# EAGLE design FX-Flash_PLCC_rev_C (EAGLE 9.6.2)
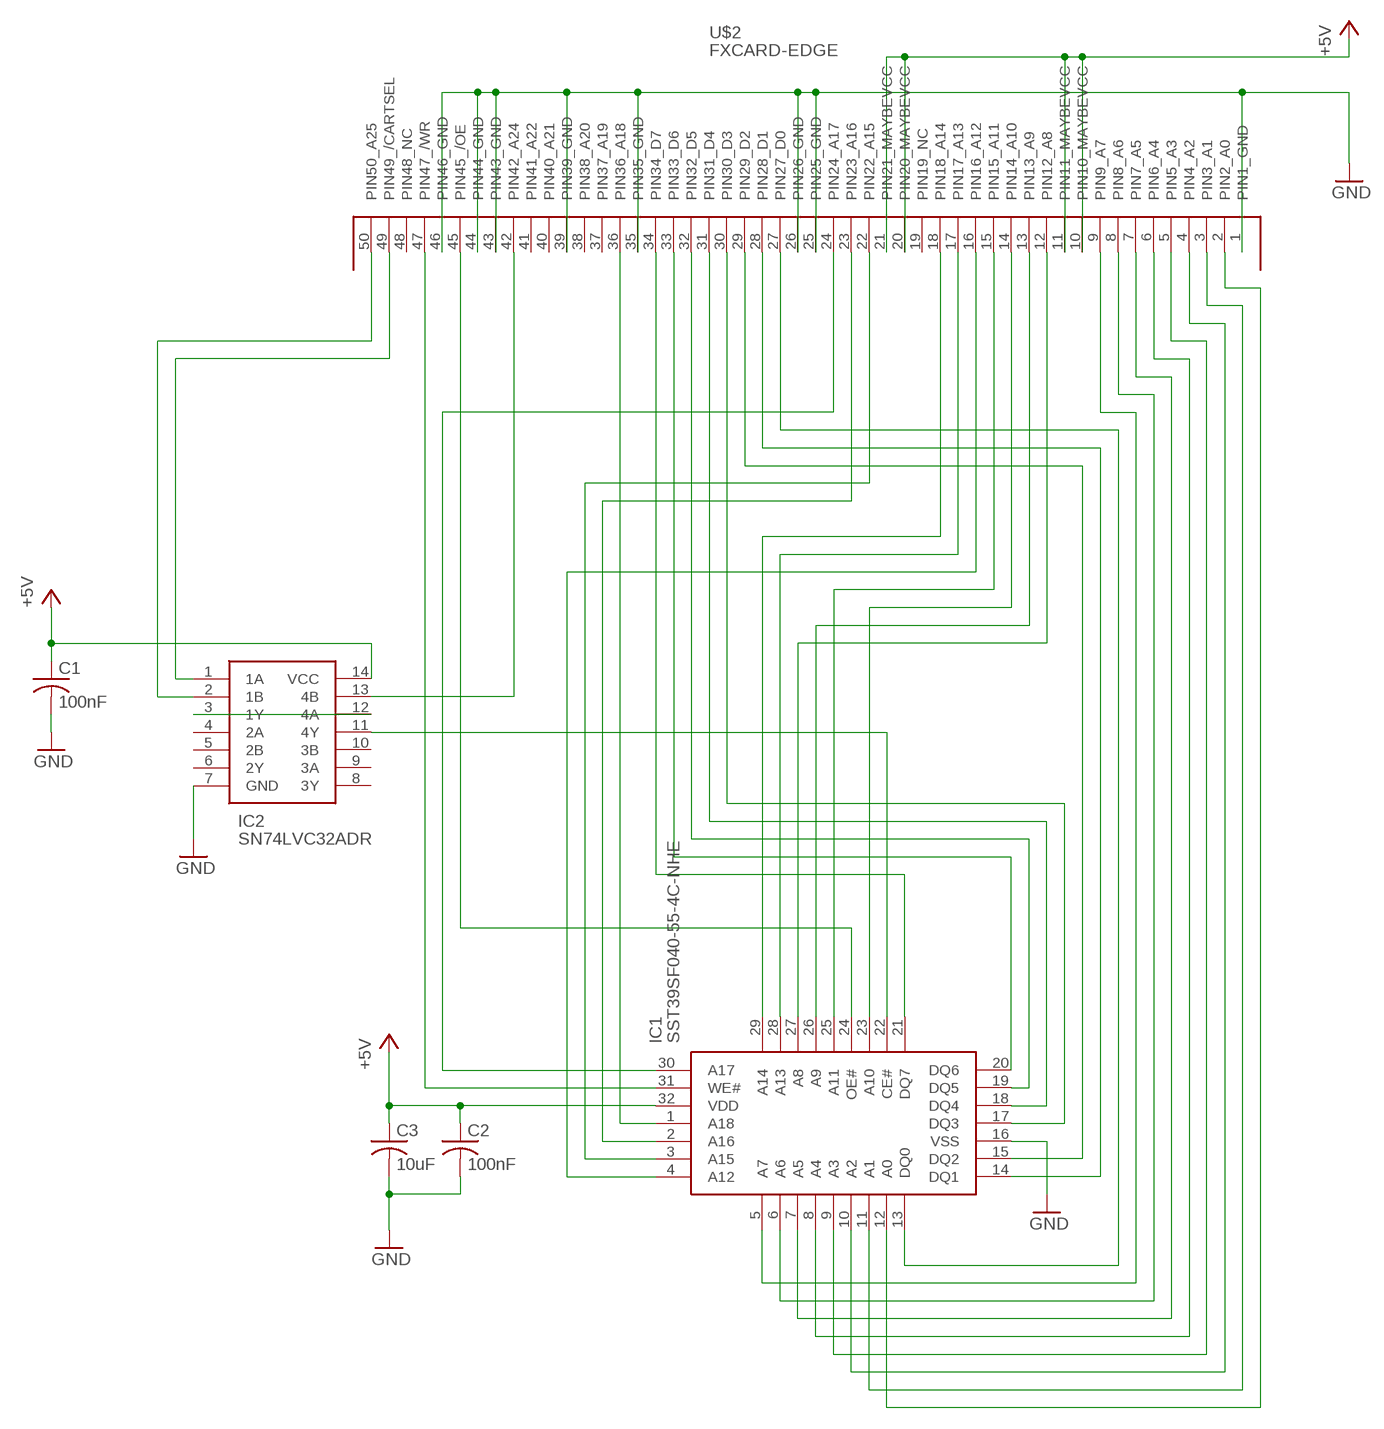
[diagram p0: schematic, sheet 1]

## Parts
C1  100nF  C-USC0805  [C0805]
C2  100nF  C-USC0805  [C0805]
C3  10uF  C-USC0805  [C0805]
IC1  SST39SF040-55-4C-NHE  [PLCC127P1245X1499X356-32N]
IC2  SN74LVC32ADR  [SOIC127P600X175-14N]
U$2  FXCARD-EDGE  [FXCARD-EDGE]

## Nets
+5V: C1.1 C2.1 C3.1 IC1.32(VDD) IC2.14(VCC) U$2.10(PIN10_MAYBEVCC) U$2.11(PIN11_MAYBEVCC) U$2.20(PIN20_MAYBEVCC) U$2.21(PIN21_MAYBEVCC)
GND: C1.2 C2.2 C3.2 IC1.16(VSS) IC2.7(GND) U$2.1(PIN1_GND) U$2.25(PIN25_GND) U$2.26(PIN26_GND) U$2.35(PIN35_GND) U$2.39(PIN39_GND) U$2.43(PIN43_GND) U$2.44(PIN44_GND) U$2.46(PIN46_GND)
N$1: IC1.18(DQ4) U$2.31(PIN31_D4)
N$2: IC1.17(DQ3) U$2.30(PIN30_D3)
N$3: IC2.13(4B) U$2.42(PIN42_A24)
N$4: IC2.3(1Y) IC2.12(4A)
N$5: IC1.22(CE#) IC2.11(4Y)
N$6: IC1.31(WE#) U$2.47(PIN47_/WR)
N$7: IC1.24(OE#) U$2.45(PIN45_/OE)
N$8: IC1.1(A18) U$2.36(PIN36_A18)
N$9: IC1.30(A17) U$2.24(PIN24_A17)
N$10: IC1.2(A16) U$2.23(PIN23_A16)
N$11: IC1.3(A15) U$2.22(PIN22_A15)
N$12: IC1.29(A14) U$2.18(PIN18_A14)
N$13: IC1.28(A13) U$2.17(PIN17_A13)
N$14: IC1.4(A12) U$2.16(PIN16_A12)
N$15: IC1.25(A11) U$2.15(PIN15_A11)
N$16: IC1.23(A10) U$2.14(PIN14_A10)
N$17: IC1.21(DQ7) U$2.34(PIN34_D7)
N$18: IC1.20(DQ6) U$2.33(PIN33_D6)
N$19: IC1.19(DQ5) U$2.32(PIN32_D5)
N$20: IC1.26(A9) U$2.13(PIN13_A9)
N$21: IC1.27(A8) U$2.12(PIN12_A8)
N$22: IC2.2(1B) U$2.50(PIN50_A25)
N$23: IC2.1(1A) U$2.49(PIN49_/CARTSEL)
N$24: IC1.15(DQ2) U$2.29(PIN29_D2)
N$25: IC1.14(DQ1) U$2.28(PIN28_D1)
N$26: IC1.13(DQ0) U$2.27(PIN27_D0)
N$27: IC1.5(A7) U$2.9(PIN9_A7)
N$28: IC1.6(A6) U$2.8(PIN8_A6)
N$29: IC1.7(A5) U$2.7(PIN7_A5)
N$30: IC1.8(A4) U$2.6(PIN6_A4)
N$31: IC1.9(A3) U$2.5(PIN5_A3)
N$32: IC1.10(A2) U$2.4(PIN4_A2)
N$33: IC1.11(A1) U$2.3(PIN3_A1)
N$34: IC1.12(A0) U$2.2(PIN2_A0)
Unconnected: IC2.4(2A) IC2.5(2B) IC2.6(2Y) IC2.8(3Y) IC2.9(3A) IC2.10(3B) U$2.19(PIN19_NC) U$2.37(PIN37_A19) U$2.38(PIN38_A20) U$2.40(PIN40_A21) U$2.41(PIN41_A22) U$2.48(PIN48_NC)

## Library data of the parts
C1-C3 = resistor:C-US: CAPACITOR, American symbol
IC1 = PC-Engine:SST39SF040-55-4C-NHE: NOR Flash 4.5 to 5.5 4Mbit Multi-Purpose Flash Source: Datasheet <http://www.microchip.com/mymicrochip/filehandler.aspx?ddocname=en551028>; ARROW_PART_NUMBER: SST39SF040-55-4C-NHE; ARROW_PRICE-STOCK: https://www.arrow.com/en/products/sst39sf040-55-4c-nhe/microchip-technology; DESCRIPTION: NOR Flash 4.5 to 5.5 4Mbit Multi-Purpose Flash; HEIGHT: 3.556mm; MANUFACTURER_NAME: Microchip; MANUFACTURER_PART_NUMBER: SST39SF040-55-4C-NHE; MOUSER_PART_NUMBER: 579-39SF0405CNHE; MOUSER_PRICE-STOCK: https://www.mouser.co.uk/ProductDetail/Microchip-Technology/SST39SF040-55-4C-NHE?qs=Ot24P6tC%2FQ41kj5UP%2FTWpA%3D%3D
IC2 = PC-Engine:SN74LVC32ADR: Texas Instruments SN74LVC32ADR, OR Quad 2 Input OR, 1.65 3.6 V, 14-Pin SOIC Source: Datasheet <http://www.ti.com/lit/gpn/sn74lvc32a>; ARROW_PART_NUMBER: SN74LVC32ADR; ARROW_PRICE-STOCK: https://www.arrow.com/en/products/sn74lvc32adr/texas-instruments; DESCRIPTION: Texas Instruments SN74LVC32ADR, OR Quad 2 Input OR, 1.65 3.6 V, 14-Pin SOIC; HEIGHT: 1.75mm; MANUFACTURER_NAME: Texas Instruments; MANUFACTURER_PART_NUMBER: SN74LVC32ADR; MOUSER_PART_NUMBER: 595-SN74LVC32ADR; MOUSER_PRICE-STOCK: https://www.mouser.co.uk/ProductDetail/Texas-Instruments/SN74LVC32ADR?qs=NLW4NjXEBS7KFLqI%2FYoHOA%3D%3D
U$2 = PC-Engine:FXCARD-EDGE

## Board
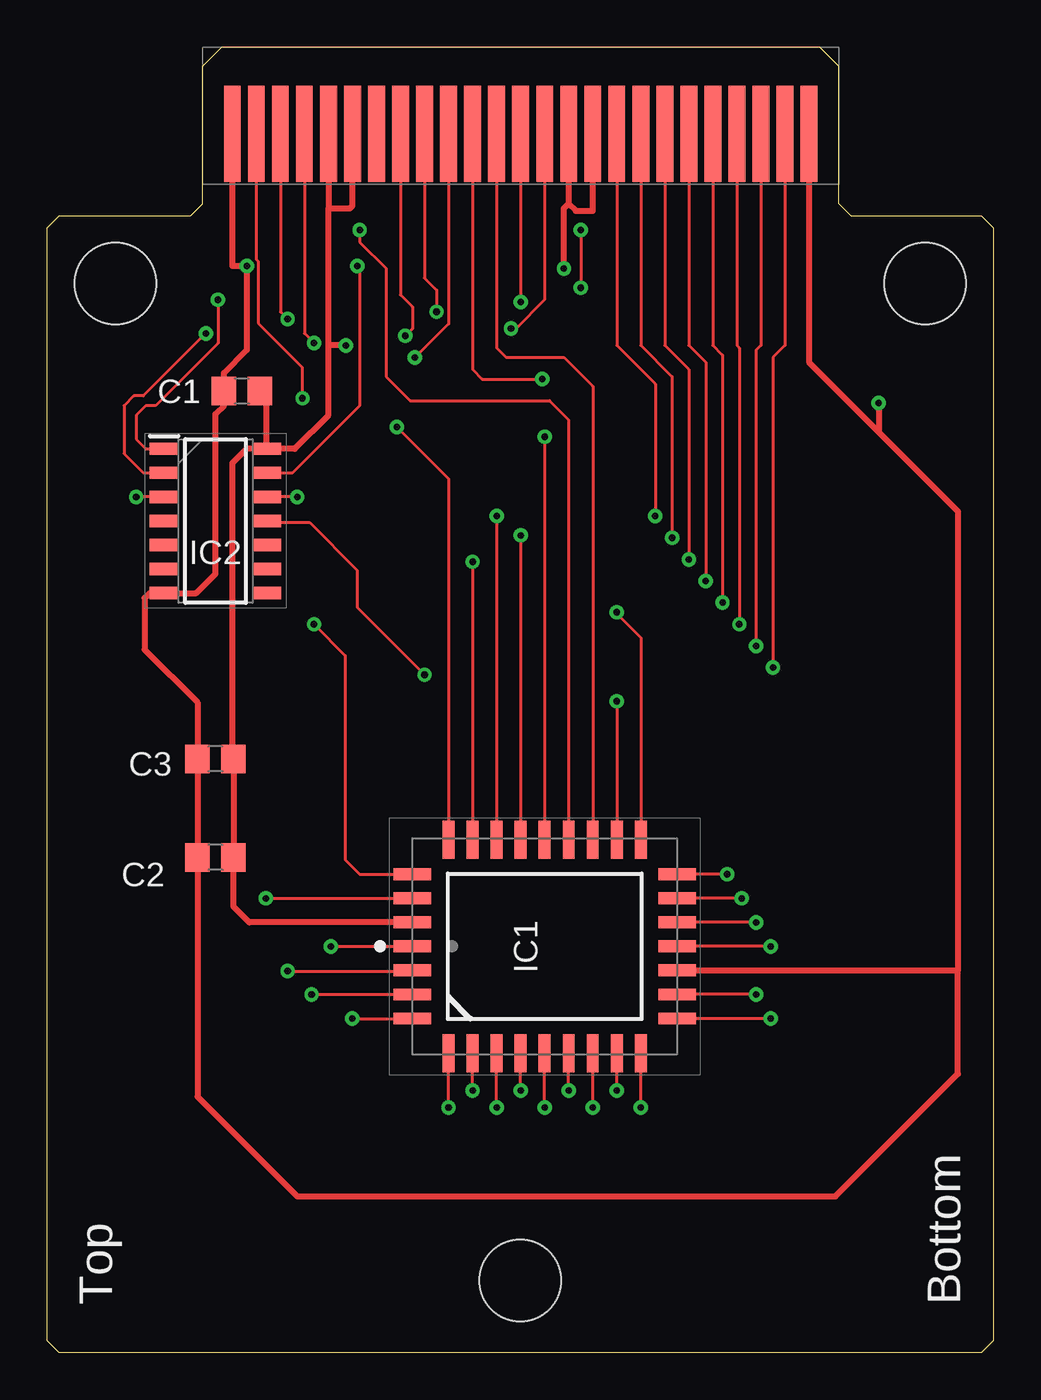
[diagram p1: board, top side]
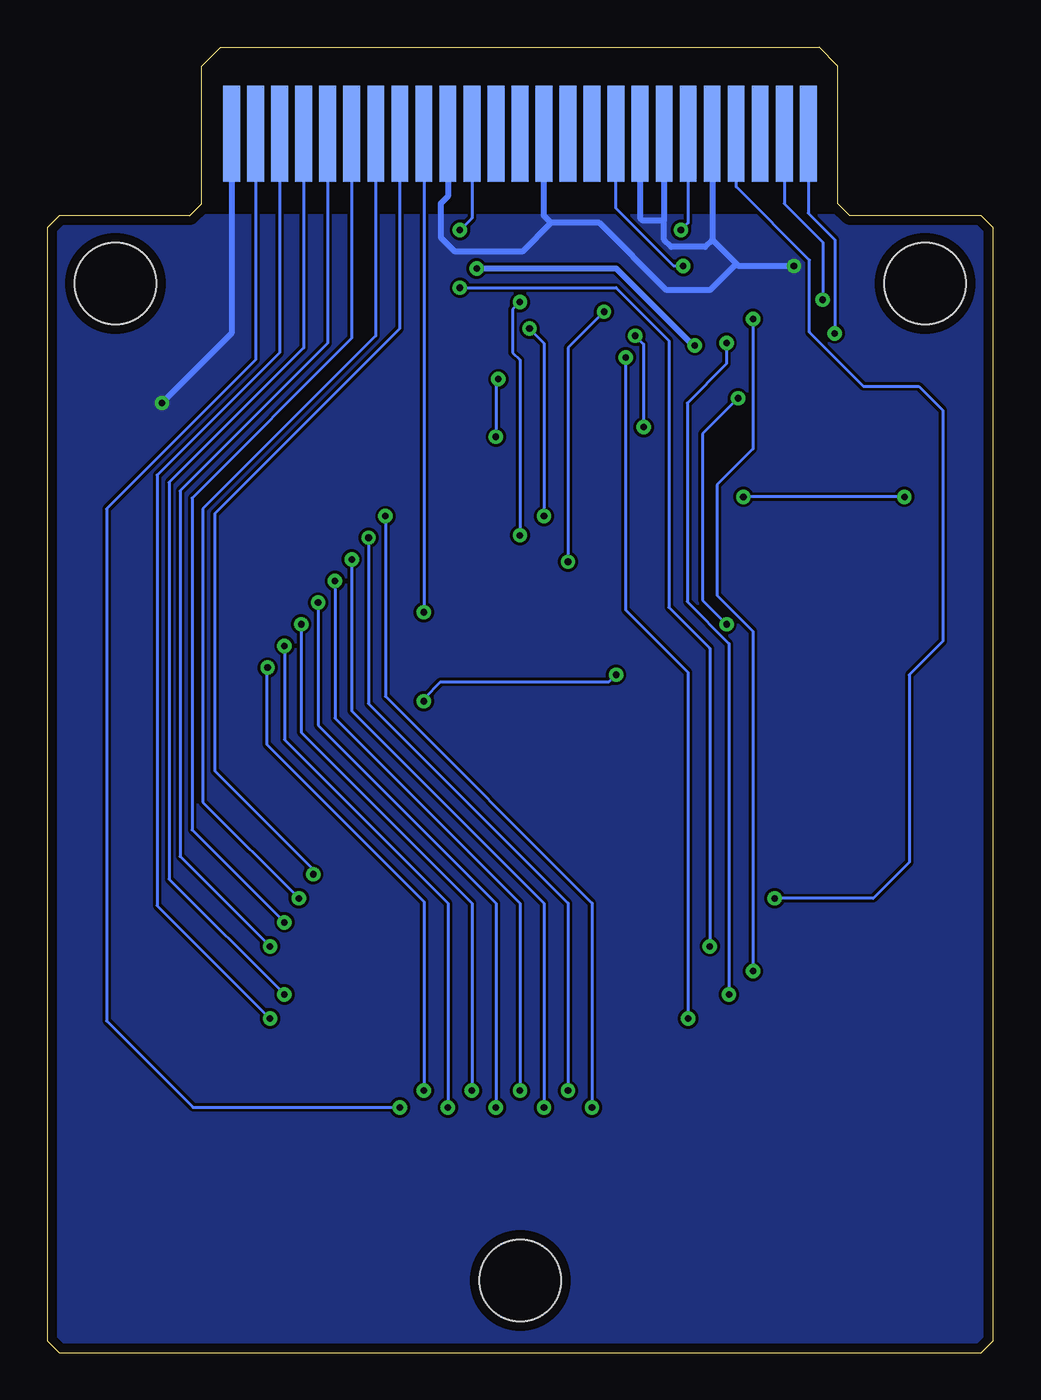
[diagram p2: board, bottom side, seen from below]

Size 50 x 68.96 mm. Coordinates in mm from the lower left corner, seen from the top.
Outline: 42.47,60.07 49.37,60.07 50,59.44 50,0.64 49.37,0 0.64,0 0,0.64 0,59.44 0.64,60.07 7.57,60.07 8.2,60.71 8.2,67.96 9.2,68.96 40.83,68.96 41.83,67.96 41.83,60.71 42.47,60.07
Copper layers (1*16): Top 0.035mm / dielectric 1.5mm / Bottom 0.035mm
Design rules "default *": minimum track width 6mil, minimum drill 0.35mm, track to track 6mil, track to pad 6mil, pad to pad 6mil, via to via 6mil, smd to smd 6mil, copper to edge 20mil, drill to drill 6mil, minimum pad ring 10mil, minimum via ring 8mil, stop-mask expansion 2mil, vias tented up to drill 15mil, thermal gap 10mil
Holes 4.3 mm at 3.6,56.49 46.4,56.49 25,3.81

### Footprints (pad centres in the part's own frame; a part is rotated, then mirrored left to right if it is on the bottom)
C0805 = smd 1.3 x 1.5: 1 -0.95,0; 2 0.95,0
PLCC127P1245X1499X356-32N = smd 0.63 x 2: 1 0,7; 2 -1.27,7; 3 -2.54,7; 4 -3.81,7; 14 -3.81,-7; 15 -2.54,-7; 16 -1.27,-7; 17 0,-7; 18 1.27,-7; 19 2.54,-7; 20 3.81,-7; 30 3.81,7; 31 2.54,7; 32 1.27,7 | smd 2 x 0.63: 5 -5.635,5.08; 6 -5.635,3.81; 7 -5.635,2.54; 8 -5.635,1.27; 9 -5.635,0; 10 -5.635,-1.27; 11 -5.635,-2.54; 12 -5.635,-3.81; 13 -5.635,-5.08; 21 5.635,-5.08; 22 5.635,-3.81; 23 5.635,-2.54; 24 5.635,-1.27; 25 5.635,0; 26 5.635,1.27; 27 5.635,2.54; 28 5.635,3.81; 29 5.635,5.08
SOIC127P600X175-14N = smd 1.525 x 0.65: 1 -2.712,3.81; 2 -2.712,2.54; 3 -2.712,1.27; 4 -2.712,0; 5 -2.712,-1.27; 6 -2.712,-2.54; 7 -2.712,-3.81; 8 2.712,-3.81; 9 2.712,-2.54; 10 2.712,-1.27; 11 2.712,0; 12 2.712,1.27; 13 2.712,2.54; 14 2.712,3.81
FXCARD-EDGE = smd 0.889 x 5.08: 1 32.055,-4.572; 2 30.785,-4.572; 3 29.515,-4.572; 4 28.245,-4.572; 5 26.975,-4.572; 6 25.705,-4.572; 7 24.435,-4.572; 8 23.165,-4.572; 9 21.895,-4.572; 10 20.625,-4.572; 11 19.355,-4.572; 12 18.085,-4.572; 13 16.815,-4.572; 14 15.545,-4.572; 15 14.275,-4.572; 16 13.005,-4.572; 17 11.735,-4.572; 18 10.465,-4.572; 19 9.195,-4.572; 20 7.925,-4.572; 21 6.655,-4.572; 22 5.385,-4.572; 23 4.115,-4.572; 24 2.845,-4.572; 25 1.575,-4.572 | smd 0.889 x 5.08 bottom: 26 32.055,-4.572; 27 30.785,-4.572; 28 29.515,-4.572; 29 28.245,-4.572; 30 26.975,-4.572; 31 25.705,-4.572; 32 24.435,-4.572; 33 23.165,-4.572; 34 21.895,-4.572; 35 20.625,-4.572; 36 19.355,-4.572; 37 18.085,-4.572; 38 16.815,-4.572; 39 15.545,-4.572; 40 14.275,-4.572; 41 13.005,-4.572; 42 11.735,-4.572; 43 10.465,-4.572; 44 9.195,-4.572; 45 7.925,-4.572; 46 6.655,-4.572; 47 5.385,-4.572; 48 4.115,-4.572; 49 2.845,-4.572; 50 1.575,-4.572

### Placement (x,y rotation side)
C1  10.29,50.8 180 top
C2  8.89,26.16 180 top
C3  8.89,31.37 180 top
IC1  26.29,21.46 90 top
IC2  8.89,43.94 0 top
U$2  8.2,68.96 0 top

### Tracks (layer width: path | path; a pad name or v marks a point on that pad's centre or on a via)
+5V  (via drill 0.35)
  Top 0.305: U$2.10 28.83,60.33 27.94,60.33 27.56,60.71 | U$2.11 27.56,60.71 | U$2.21 14.86,60.45 | 14.86,53.21 14.86,49.53 13.08,47.75 IC2.14 | 14.86,53.21 14.86,60.45 | IC2.14 10.54,47.75 9.78,46.99 9.78,31.43 C3.1 C2.1 9.84,23.56 10.67,22.73 IC1.32 | 14.86,60.45 16,60.45 16.13,60.58 U$2.20 | v15.78,53.21 14.86,53.21 | v27.3,57.28 27.3,60.45 27.56,60.71 | IC2.14 11.6,50.44 C1.1
  Bottom 0.305: v27.3,57.28 19.94,57.28 15.88,53.21 v15.78,53.21
GND  (via drill 0.35)
  Top 0.152: 43.94,48.64 44.51,48.07
  Top 0.305: U$2.1 40.26,52.32 44.51,48.07 48.13,44.45 48.13,20.19 | v43.94,50.16 43.94,48.64 | U$2.25 9.78,57.4 v10.54,57.4 10.54,52.96 9.34,51.76 C1.2 9.34,50.04 8.89,49.59 8.89,41.15 7.87,40.13 IC2.7 5.42,40.13 5.15,39.86 5.15,37.15 7.94,34.35 C3.2 C2.2 7.94,13.52 13.21,8.26 41.66,8.26 48.13,14.73 48.13,20.19 | IC1.16 48.13,20.19
  Bottom 0.305: U$2.1 40.26,53.85 v43.94,50.16 | U$2.44 17.4,59.82 | U$2.46 14.86,58.8 | 17.4,59.82 17.4,58.8 17.02,58.42 15.24,58.42 14.86,58.8 | v10.54,57.4 13.46,57.4 13.59,57.53 | 14.86,58.8 13.59,57.53 | 13.59,57.53 14.99,56.13 17.27,56.13 20.83,59.69 23.37,59.69 | 23.37,59.69 23.75,60.07 U$2.39 | U$2.35 28.83,61.09 29.21,60.71 29.21,58.93 28.45,58.17 24.89,58.17 23.37,59.69 | 17.4,59.82 18.54,59.82 18.67,59.94 U$2.43
  pour Bottom: -0.76,-0.64 -0.76,59.31 0,60.07 50.55,60.07 50.55,-0.64
N$1  (via drill 0.35)
  Top 0.152: v37.47,22.73 IC1.18
  Bottom 0.152: U$2.31 33.91,53.59 42.35,45.15 42.35,27.62 v37.47,22.73
N$2  (via drill 0.35)
  Top 0.152: v38.23,21.46 IC1.17
  Bottom 0.152: U$2.30 35.18,53.34 42.99,45.53 42.99,26.23 v38.23,21.46
N$3  (via drill 0.35)
  Top 0.152: IC2.13 12.95,46.48 16.51,50.04 16.51,57.28 v16.38,57.4
  Bottom 0.152: v16.38,57.4 16.89,57.4 19.94,60.45 U$2.42
N$4  (via drill 0.35)
  Top 0.152: v13.21,45.21 IC2.12 | IC2.3 v4.7,45.21
  Bottom 0.152: v4.7,45.21 v13.21,45.21
N$5  (via drill 0.35)
  Top 0.152: IC2.11 11.68,43.86 13.86,43.86 16.38,41.33 16.38,39.37 v19.94,35.81 | v30.1,34.42 IC1.22
  Bottom 0.152: v19.94,35.81 20.32,35.43 29.21,35.43 30.1,34.54 v30.1,34.42
N$6  (via drill 0.35)
  Top 0.152: v11.56,24 IC1.31
  Bottom 0.152: U$2.47 13.59,61.59 9.72,57.72 9.72,53.91 6.86,51.05 3.94,51.05 2.67,49.78 2.67,37.59 4.45,35.81 4.45,25.91 6.35,24 v11.56,24
N$7  (via drill 0.35)
  Top 0.152: v16.51,59.31 16.51,58.67 17.91,57.28 17.91,51.56 19.18,50.29 26.54,50.29 27.56,49.28 IC1.24
  Bottom 0.152: U$2.45 16.13,59.69 v16.51,59.31
N$8  (via drill 0.35)
  Top 0.152: v28.19,59.31 v28.19,56.26 | v14.99,21.46 IC1.1
  Bottom 0.152: v28.19,56.26 19.94,56.26 17.14,53.47 17.14,39.37 14.99,37.21 v14.99,21.46 | U$2.36 27.56,59.94 v28.19,59.31
N$9  (via drill 0.35)
  Top 0.152: U$2.24 11.05,57.75 11.15,57.66 11.15,54.38 13.46,52.07 13.46,50.45 v13.49,50.42 | v14.1,38.48 15.75,36.83 15.75,26.04 16.51,25.27 IC1.30
  Bottom 0.152: v13.49,50.42 15.37,48.54 15.37,39.75 v14.1,38.48
N$10  (via drill 0.35)
  Top 0.152: U$2.23 12.32,54.99 v12.7,54.61 | v12.7,20.16 19.72,20.16 IC1.2
  Bottom 0.152: v12.7,54.61 12.7,47.75 14.61,45.85 14.61,40.01 12.7,38.1 v12.7,20.16
N$11  (via drill 0.35)
  Top 0.152: U$2.22 13.59,53.85 v14.1,53.34 | v13.97,18.92 IC1.3
  Bottom 0.152: v14.1,53.34 14.1,52.25 16.18,50.16 16.18,39.67 13.97,37.47 v13.97,18.92
N$12  (via drill 0.35)
  Top 0.152: U$2.18 18.67,55.88 19.3,55.24 19.3,54.1 v18.92,53.72 | v18.48,48.9 21.21,46.16 IC1.29
  Bottom 0.152: v18.92,53.72 18.48,53.28 v18.48,48.9
N$13  (via drill 0.35)
  Top 0.152: U$2.17 19.94,56.77 20.57,56.13 v20.57,54.99 | v22.48,41.78 IC1.28
  Bottom 0.152: v20.57,54.99 22.48,53.09 v22.48,41.78
N$14  (via drill 0.35)
  Top 0.152: U$2.16 21.21,54.36 v19.43,52.58 | v16.13,17.65 IC1.4
  Bottom 0.152: v19.43,52.58 19.43,39.24 16.13,35.94 v16.13,17.65
N$15  (via drill 0.35)
  Top 0.152: U$2.15 22.48,51.94 22.99,51.44 v26.16,51.44 | v26.29,48.39 IC1.25
  Bottom 0.152: v26.16,51.44 26.29,51.31 v26.29,48.39
N$16
  Top 0.152: U$2.14 23.75,53.09 24.26,52.58 27.3,52.58 28.83,51.05 IC1.23
N$17  (via drill 0.35)
  Top 0.152: v30.1,39.12 30.1,39.04 31.37,37.77 IC1.21
  Bottom 0.152: U$2.34 v30.1,39.12
N$18  (via drill 0.35)
  Top 0.152: v35.94,25.27 IC1.20
  Bottom 0.152: U$2.33 31.37,54.1 41.15,44.32 41.15,30.73 35.94,25.53 v35.94,25.27
N$19  (via drill 0.35)
  Top 0.152: v36.7,24 IC1.19
  Bottom 0.152: U$2.32 32.64,53.72 41.78,44.58 41.78,29.08 v36.7,24
N$20  (via drill 0.35)
  Top 0.152: U$2.13 v25.02,55.5 | v25.02,43.18 IC1.26
  Bottom 0.152: v25.02,55.5 25.4,55.12 25.4,52.83 25.02,52.45 v25.02,43.18
N$21  (via drill 0.35)
  Top 0.152: U$2.12 26.29,55.63 24.77,54.1 v24.51,54.1 | v23.75,44.2 IC1.27
  Bottom 0.152: v24.51,54.1 23.75,53.34 v23.75,44.2
N$22  (via drill 0.35)
  Top 0.152: IC2.2 5.08,46.48 4.06,47.5 4.06,50.04 4.57,50.55 5.08,50.55 v8.38,53.85
  Bottom 0.152: U$2.50 9.78,60.2 8.38,58.8 v8.38,53.85
N$23  (via drill 0.35)
  Top 0.152: IC2.1 5.21,47.75 4.7,48.26 4.7,49.53 5.21,50.04 5.71,50.04 9.02,53.34 v9.02,55.63
  Bottom 0.152: U$2.49 11.05,60.71 9.02,58.67 v9.02,55.63
N$24  (via drill 0.35)
  Top 0.152: v37.47,18.92 IC1.15
  Bottom 0.152: U$2.29 36.45,53.09 43.56,45.97 43.56,25.02 v37.47,18.92
N$25  (via drill 0.35)
  Top 0.152: v38.23,17.65 IC1.14
  Bottom 0.152: U$2.28 37.72,52.83 44.2,46.35 44.2,23.62 v38.23,17.65
N$26  (via drill 0.35)
  Top 0.152: v31.37,12.95 IC1.13
  Bottom 0.152: U$2.27 38.99,52.45 46.86,44.58 46.86,17.53 42.29,12.95 v31.37,12.95
N$27  (via drill 0.35)
  Top 0.152: U$2.9 30.1,53.21 32.13,51.18 v32.13,44.2 | v21.21,12.95 IC1.5
  Bottom 0.152: v32.13,44.2 32.13,34.67 21.21,23.75 v21.21,12.95
N$28  (via drill 0.35)
  Top 0.152: U$2.8 31.37,53.21 33.02,51.56 v33.02,43.05 | v22.48,13.84 IC1.6
  Bottom 0.152: v33.02,43.05 33.02,34.29 22.48,23.75 v22.48,13.84
N$29  (via drill 0.35)
  Top 0.152: U$2.7 32.64,53.21 33.91,51.94 v33.91,41.91 | v23.75,12.95 IC1.7
  Bottom 0.152: v33.91,41.91 33.91,33.91 23.75,23.75 v23.75,12.95
N$30  (via drill 0.35)
  Top 0.152: U$2.6 33.91,53.21 34.8,52.32 v34.8,40.77 | v25.02,13.84 IC1.8
  Bottom 0.152: v34.8,40.77 34.8,33.53 25.02,23.75 v25.02,13.84
N$31  (via drill 0.35)
  Top 0.152: U$2.5 35.18,53.21 35.69,52.7 v35.69,39.62 | v26.29,12.95 IC1.9
  Bottom 0.152: v35.69,39.62 35.69,33.15 26.29,23.75 v26.29,12.95
N$32  (via drill 0.35)
  Top 0.152: U$2.4 36.45,53.21 36.58,53.09 v36.58,38.48 | v27.56,13.84 IC1.10
  Bottom 0.152: v36.58,38.48 36.58,32.77 27.56,23.75 v27.56,13.84
N$33  (via drill 0.35)
  Top 0.152: U$2.3 37.72,53.21 37.47,52.96 v37.47,37.34 | v28.83,12.95 IC1.11
  Bottom 0.152: v37.47,37.34 37.47,32.38 28.83,23.75 v28.83,12.95
N$34  (via drill 0.35)
  Top 0.152: U$2.2 38.99,53.21 38.35,52.58 v38.35,36.2 | v30.1,13.84 IC1.12
  Bottom 0.152: v38.35,36.2 38.41,36.14 38.41,32.13 30.1,23.83 v30.1,13.84

### Text on the board
tNames: Top | Bottom
tValues: 25 | 1 | FX-Flash | Board Rev. C | Prototype by / David Shadoff / (c) 2022
bValues: 50 | 26 | JLCJLCJLCJLC